# EasyEDA Pro project ProProject_基于STM32的Buck-Boost型数字电源_2024-06-04.epro, board PCB1
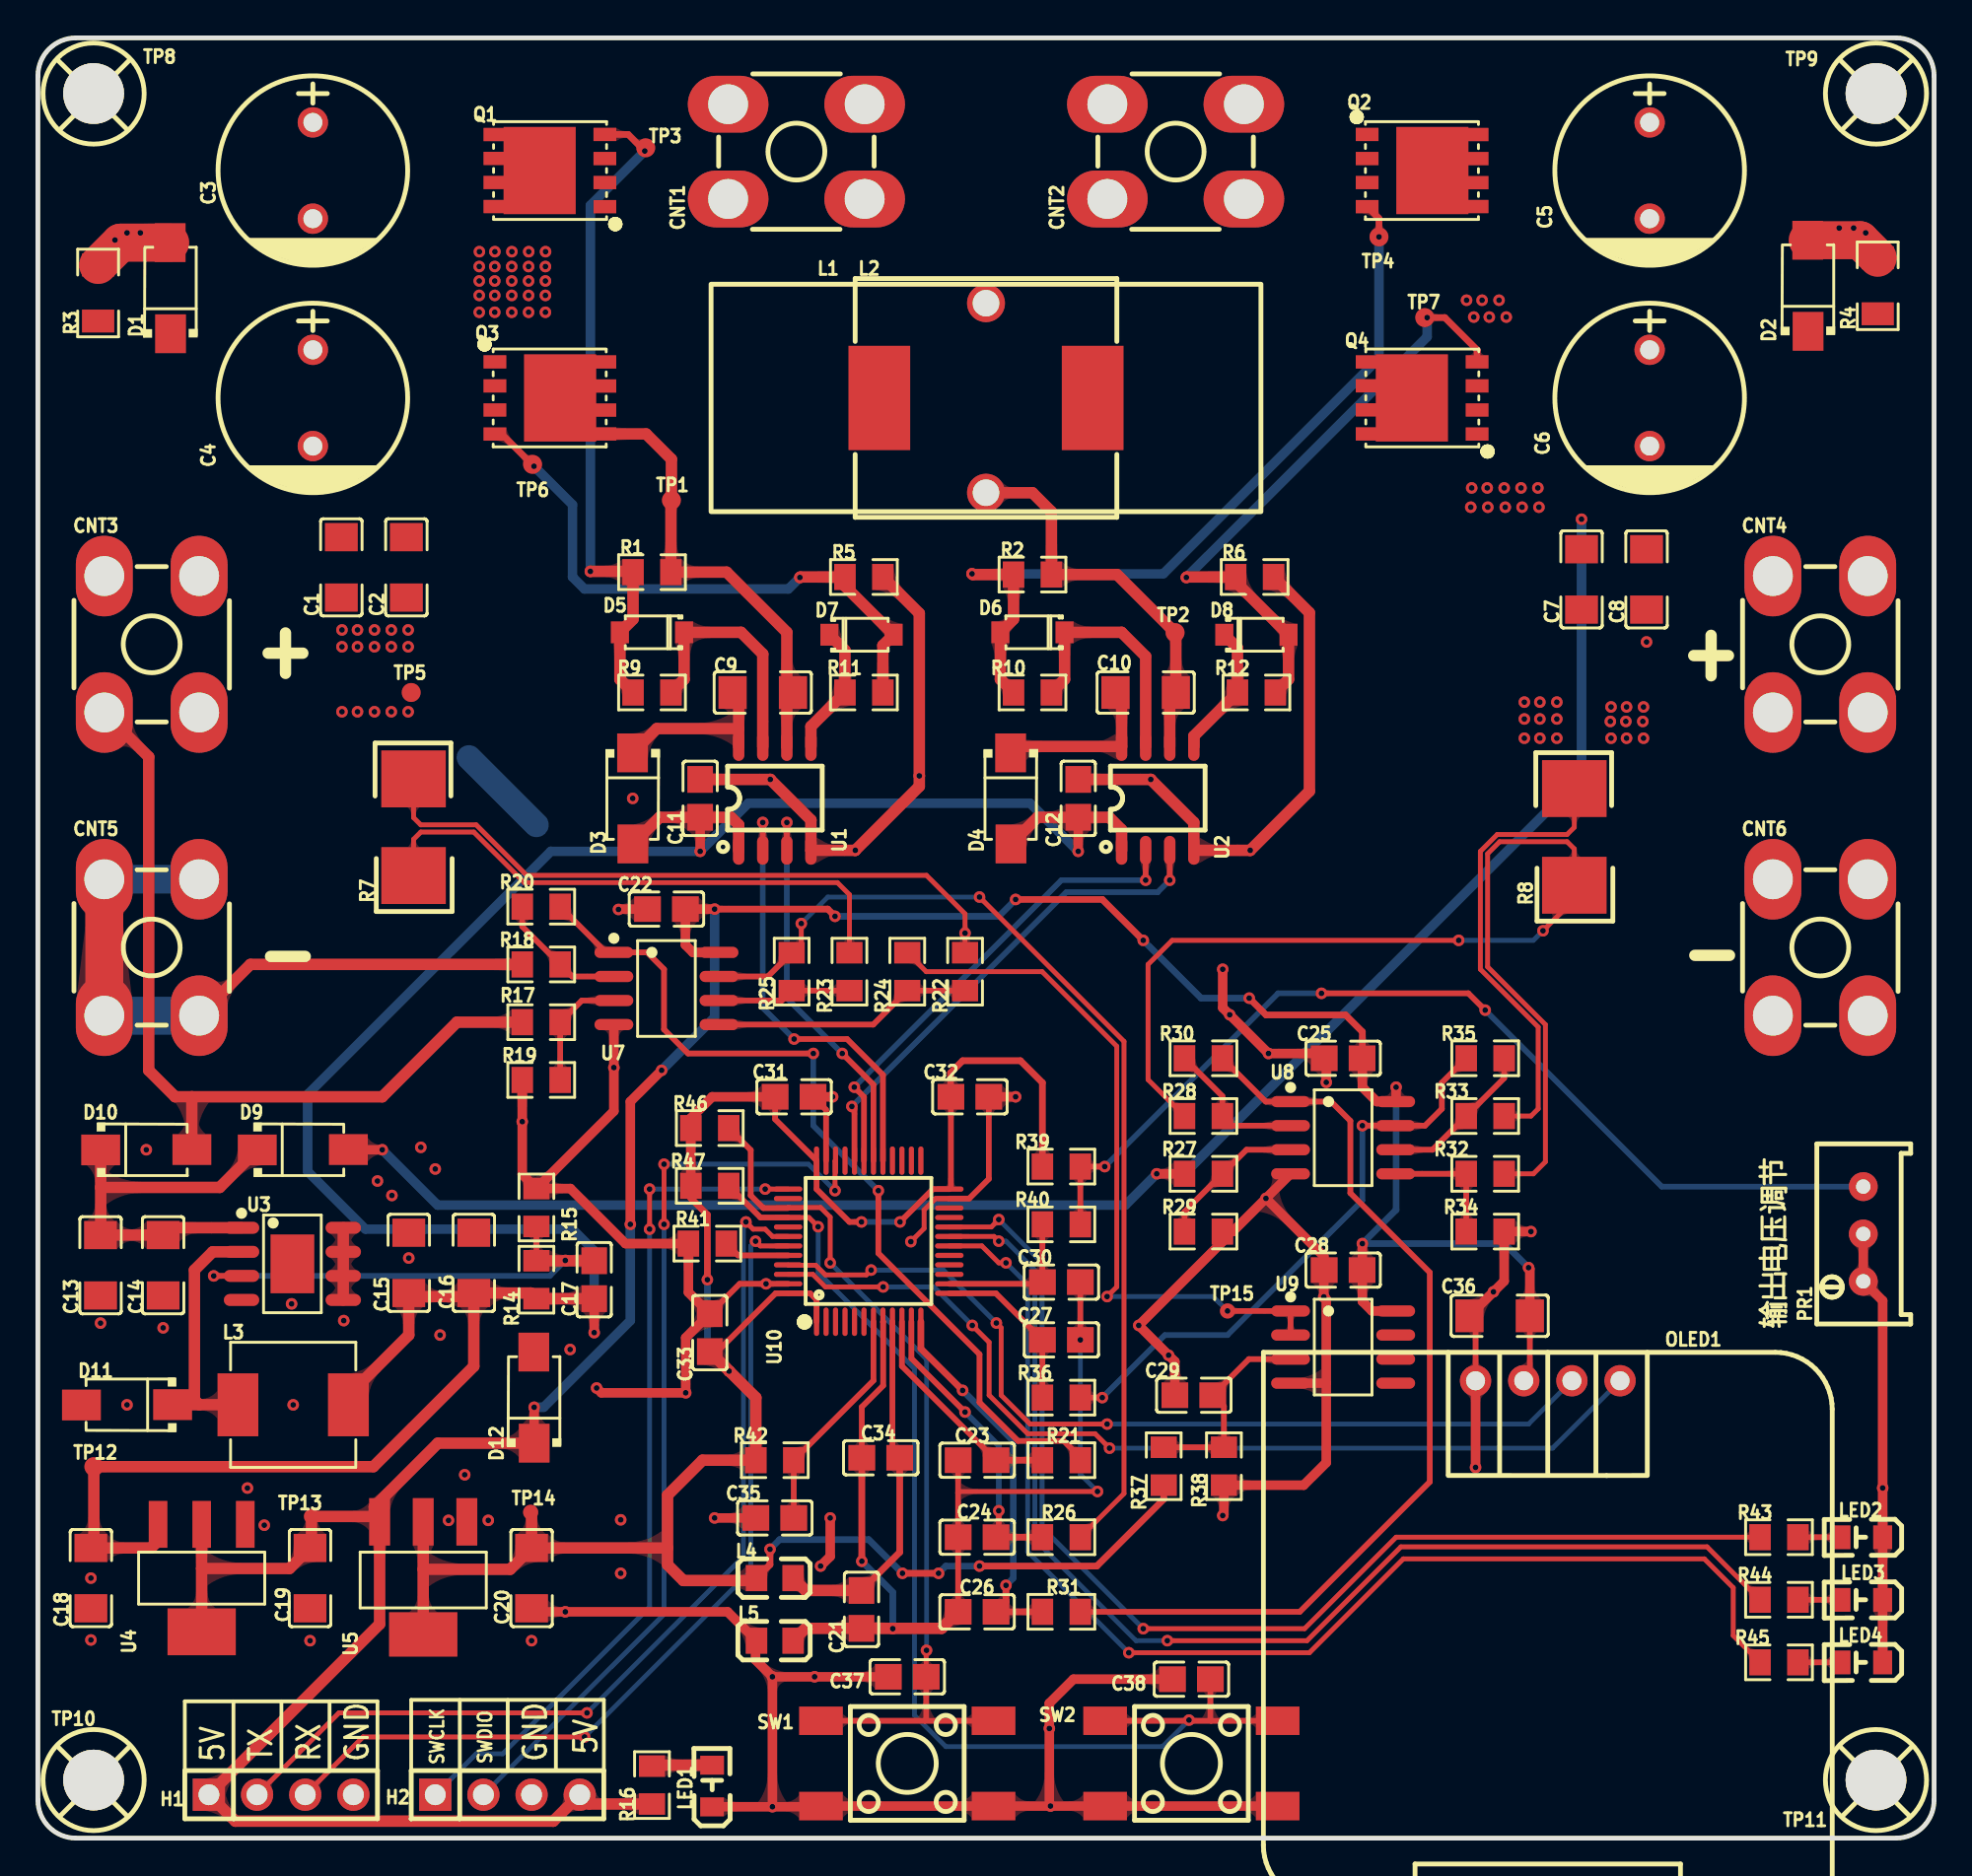
[diagram p13: board, top side]
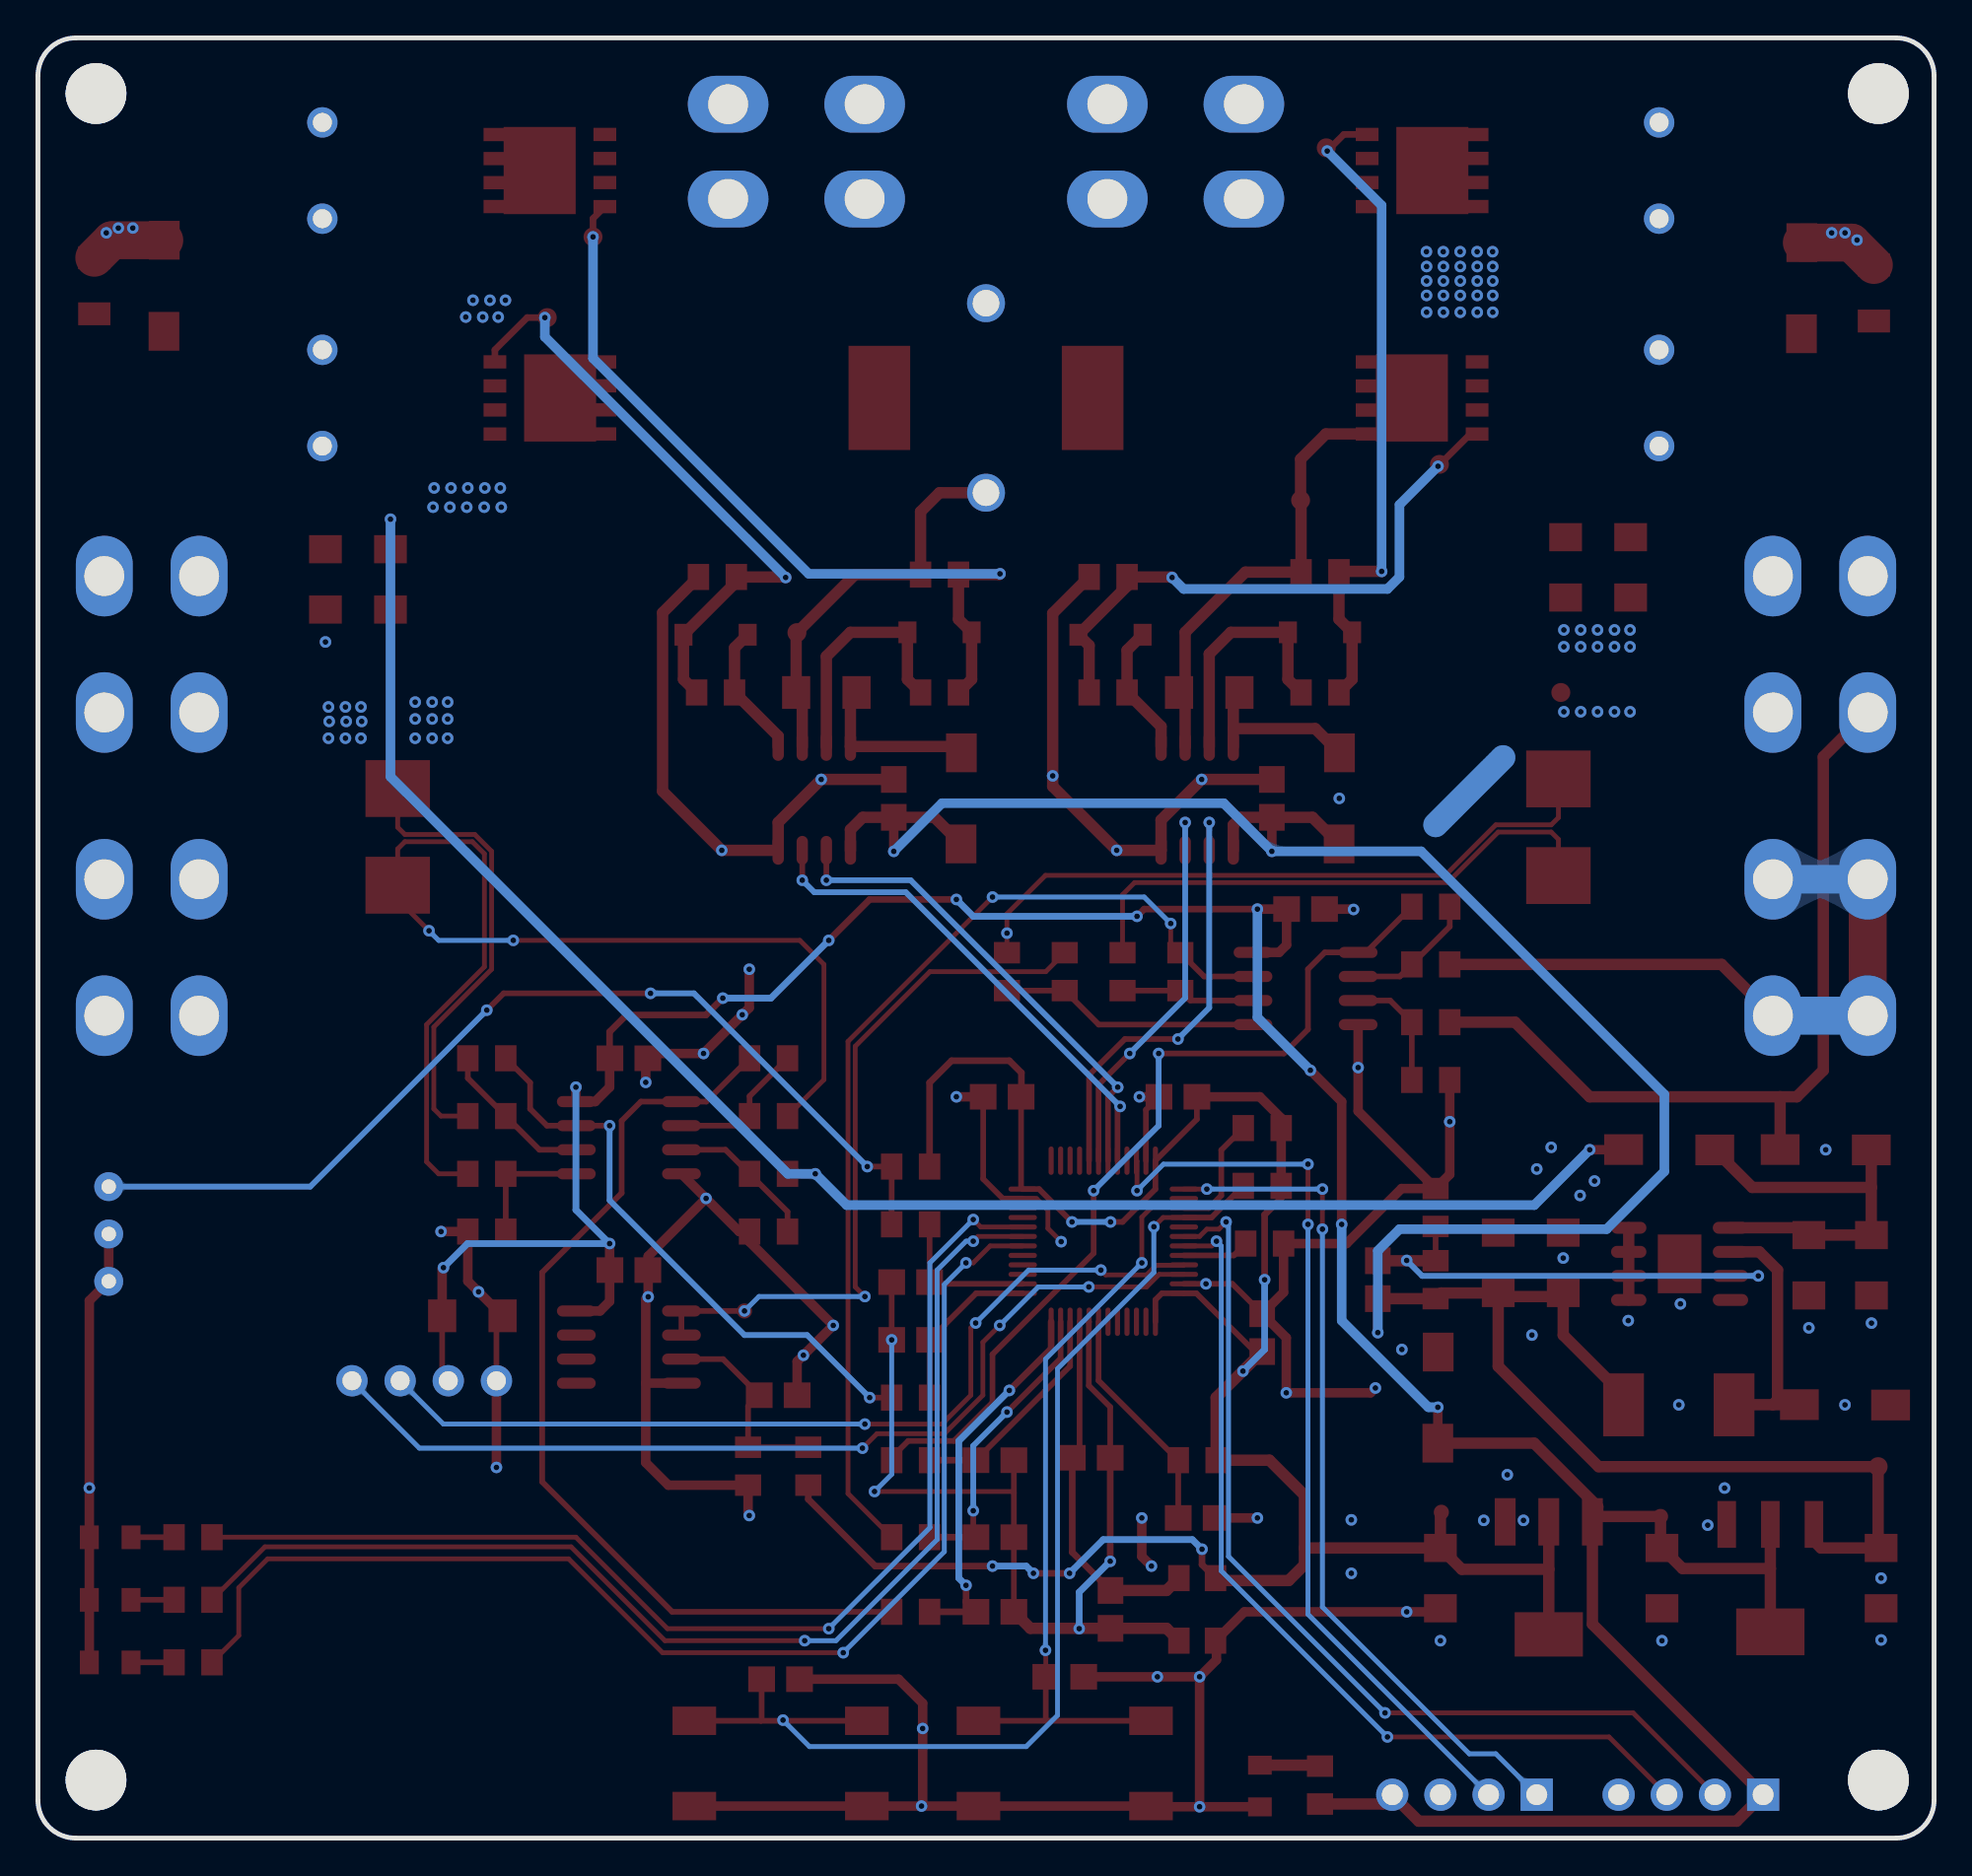
[diagram p14: board, bottom side, seen from below]

Outline 100 x 95 mm; copper layers: Top Layer, Bottom Layer. Coordinates in mm from the lower left corner of the outline.
Outline path: 0,93 0,2 arc(0.59,0.59) 2,0 98,0 arc(99.41,0.59) 100,2 100,93 arc(99.41,94.41) 98,95 2,95 arc(0.59,94.41) 0,93
Stack: Top Layer 0.035mm / Dielectric1 1.51mm FR4 er 4.5 / Bottom Layer 0.035mm

## Design rules (mm)
template: 自定义配置
spacing copperThickness1oz (default): track to track 0.102, other pairs 0.152 to 0.3
spacing copperThickness2oz: track to track 0.203, other pairs 0.152 to 0.3
track width copperThickness1oz (default): min 0.127, default 0.254, max 2.54
track width copperThickness2oz: min 0.203, default 0.254, max 2.54
differential pair differentialPair (default): width min 0.127, default 0.254, max 2.54; gap min 0.152, default 0.152
via viaSize (default): diameter min 0.5, default 0.61, max 10; hole min 0.3, default 0.305, max 6.3
net VIN+ uses 直连
net VIN- uses 直连
net GND uses 直连
net HS-1 uses 直连
net $1N2170 uses 直连
net HS-2 uses 直连
net VOUT+ uses 直连
net VOUT- uses 直连

## Placement (name value [footprint] x y rotation side)
C1  10uF  [C1206]  16 67.06 90 top
C2  10uF  [C1206]  19.43 67.06 90 top
C3  220uF  [CAP-TH_BD10.0-P5.00-D1.0-FD]  14.5 88 270 top
C4  220uF  [CAP-TH_BD10.0-P5.00-D1.0-FD]  14.5 76 270 top
C5  220uF  [CAP-TH_BD10.0-P5.00-D1.0-FD]  85 88 270 top
C6  220uF  [CAP-TH_BD10.0-P5.00-D1.0-FD]  85 76 270 top
C7  10uF  [C1206]  81.41 66.42 90 top
C8  10uF  [C1206]  84.84 66.42 90 top
C9  10uF  [C1206]  38.23 60.46 180 top
C10  10uF  [C1206]  58.42 60.46 180 top
C11  470nF  [C0805]  34.93 54.87 270 top
C12  470nF  [C0805]  54.86 54.87 270 top
C13  10uF  [C1206]  3.3 30.23 90 top
C14  10uF  [C1206]  6.6 30.23 90 top
C15  10uF  [C1206]  19.56 30.36 270 top
C16  10uF  [C1206]  22.99 30.36 270 top
C17  330pF  [C0805]  29.34 29.47 270 top
C18  10uF  [C1206]  2.79 13.72 90 top
C19  10uF  [C1206]  14.35 13.72 90 top
C20  10uF  [C1206]  26.03 13.72 90 top
C21  470nF  [C0805]  43.43 12.07 90 top
C22  470nF  [C0805]  33.15 49.03 180 top
C23  330pF  [C0805]  49.53 19.94 0 top
C24  330pF  [C0805]  49.53 15.88 0 top
C25  470nF  [C0805]  68.83 41.15 180 top
C26  330pF  [C0805]  49.53 11.94 0 top
C27  330pF  [C0805]  53.97 26.29 180 top
C28  470nF  [C0805]  68.83 29.98 180 top
C29  470nF  [C0805]  60.96 23.37 0 top
C30  470nF  [C0805]  53.97 29.34 180 top
C31  470nF  [C0805]  39.88 39.12 0 top
C32  470nF  [C0805]  49.15 39.12 0 top
C33  470nF  [C0805]  35.43 26.67 90 top
C34  470nF  [C0805]  44.45 20.07 0 top
C35  470nF  [C0805]  38.86 16.9 0 top
C36  10uF  [C1206]  77.09 27.56 0 top
C37  470nF  [C0805]  45.85 8.51 180 top
C38  470nF  [C0805]  60.83 8.39 180 top
CNT1  T34001  [CONN-TH_T34001]  40 89 90 top
CNT2  T34001  [CONN-TH_T34001]  60 89 90 top
CNT3  T34001  [CONN-TH_T34001]  6 63 0 top
CNT4  T34001  [CONN-TH_T34001]  94 63 0 top
CNT5  T34001  [CONN-TH_T34001]  6 47 0 top
CNT6  T34001  [CONN-TH_T34001]  94 47 0 top
D1  SS210  [SMA_L4.3-W2.6-LS5.0-RD]  6.98 81.79 90 top
D2  SS210  [SMA_L4.3-W2.6-LS5.0-RD]  93.34 81.92 90 top
D3  SS210  [SMA_L4.3-W2.6-LS5.0-RD]  31.37 54.87 270 top
D4  SS210  [SMA_L4.3-W2.6-LS5.0-RD]  51.31 54.87 270 top
D5  1N4148W  [SOD-123_L2.8-W1.8-LS3.7-RD]  32.38 63.63 180 top
D6  1N4148W  [SOD-123_L2.8-W1.8-LS3.7-RD]  52.45 63.63 180 top
D7  1N4148W  [SOD-123_L2.8-W1.8-LS3.7-RD]  43.43 63.5 0 top
D8  1N4148W  [SOD-123_L2.8-W1.8-LS3.7-RD]  64.26 63.5 0 top
D9  SS210  [SMA_L4.3-W2.6-LS5.0-RD]  13.97 36.33 0 top
D10  SS210  [SMA_L4.3-W2.6-LS5.0-RD]  5.72 36.33 0 top
D11  SS210  [SMA_L4.3-W2.6-LS5.0-RD]  4.7 22.86 180 top
D12  SS210  [SMA_L4.3-W2.6-LS5.0-RD]  26.16 23.25 90 top
H1  -  [HDR-TH_4P-P2.54-V-M]  12.83 2.29 0 top
H2  -  [HDR-TH_4P-P2.54-V-M]  24.77 2.29 0 top
L1  22uH  [IND-TH_L29.0-W12.0-P10.00]  50 76 270 top
L2  22uH  [IND-SMD_L13.5-W12.6_XR_XR1265]  50 76 0 top
L3  100uH  [IND-SMD_L7.1-W6.6]  13.46 22.86 0 top
L4  10uH  [L0805]  38.86 13.72 0 top
L5  10uH  [L0805]  38.86 10.42 0 top
LED1  NCD0805R1  [LED_0805]  35.56 2.8 90 top
LED2  NCD0805R1  [LED_0805]  96.14 15.88 180 top
LED3  NCD0805R1  [LED_0805]  96.14 12.58 180 top
LED4  NCD0805R1  [LED_0805]  96.14 9.28 180 top
OLED1  HS96L03W2C03  [0.96OLED_4P]  79.63 24.13 0 top
PR1  50kΩ  [R_3296]  96.14 31.88 90 top
Q1  CJAC80SN10  [PDFN-8_L5.8-W5.0-P1.27-LS6.0-BL]  27 88 90 top
Q2  CJAC80SN10  [PDFN-8_L5.8-W5.0-P1.27-LS6.0-BL]  73 88 270 top
Q3  CJAC80SN10  [PDFN-8_L5.8-W5.0-P1.27-LS6.0-BL]  27 76 270 top
Q4  CJAC80SN10  [PDFN-8_L5.8-W5.0-P1.27-LS6.0-BL]  73 76 90 top
R1  10kΩ  [R0805]  32.38 66.81 180 top
R2  10kΩ  [R0805]  52.45 66.68 180 top
R3  10kΩ  [R1206]  3.17 81.54 270 top
R4  10kΩ  [R1206]  97.03 81.92 270 top
R5  10kΩ  [R0805]  43.56 66.55 180 top
R6  10kΩ  [R0805]  64.17 66.55 180 top
R7  1mΩ  [RES-SMD_L6.4-W3.2-A]  19.81 53.34 90 top
R8  1mΩ  [RES-SMD_L6.4-W3.2-A]  81.03 52.84 90 top
R9  10Ω  [R0805]  32.38 60.46 0 top
R10  10Ω  [R0805]  52.45 60.46 0 top
R11  10Ω  [R0805]  43.56 60.46 180 top
R12  10Ω  [R0805]  64.26 60.46 180 top
R14  27kΩ  [R0805]  26.29 29.47 90 top
R15  3kΩ  [R0805]  26.29 33.28 90 top
R16  3kΩ  [R0805]  32.38 2.8 90 top
R17  68kΩ  [R0805]  26.54 43.06 0 top
R18  68kΩ  [R0805]  26.54 46.11 0 top
R19  3.3kΩ  [R0805]  26.54 40.01 180 top
R20  3.3kΩ  [R0805]  26.54 49.15 180 top
R21  100Ω  [R0805]  53.97 19.94 0 top
R22  100Ω  [R0805]  48.9 45.72 270 top
R23  100Ω  [R0805]  42.8 45.72 270 top
R24  15kΩ  [R0805]  45.85 45.72 90 top
R25  15kΩ  [R0805]  39.75 45.72 270 top
R26  100Ω  [R0805]  53.97 15.88 0 top
R27  68kΩ  [R0805]  61.47 35.06 0 top
R28  68kΩ  [R0805]  61.47 38.1 0 top
R29  3.3kΩ  [R0805]  61.47 32.01 0 top
R30  3.3kΩ  [R0805]  61.47 41.15 180 top
R31  100Ω  [R0805]  53.97 11.94 0 top
R32  100Ω  [R0805]  76.33 35.06 180 top
R33  100Ω  [R0805]  76.33 38.1 180 top
R34  15kΩ  [R0805]  76.33 32.01 0 top
R35  15kΩ  [R0805]  76.33 41.15 0 top
R36  100Ω  [R0805]  53.97 23.25 0 top
R37  3.3kΩ  [R0805]  59.37 19.63 270 top
R38  3.3kΩ  [R0805]  62.55 19.63 90 top
R39  10kΩ  [R0805]  53.97 35.44 0 top
R40  3.3kΩ  [R0805]  53.97 32.39 0 top
R41  1kΩ  [R0805]  35.31 31.37 180 top
R42  10kΩ  [R0805]  38.86 19.94 180 top
R43  3kΩ  [R0805]  91.82 15.88 0 top
R44  3kΩ  [R0805]  91.82 12.58 0 top
R45  3kΩ  [R0805]  91.82 9.28 0 top
R46  10kΩ  [R0805]  35.43 37.47 0 top
R47  10kΩ  [R0805]  35.43 34.42 0 top
SW1  KH-6X6X5H-STM  [SW-SMD_4P-L6.0-W6.0-P4.50-LS9.0-2]  45.85 3.94 0 top
SW2  KH-6X6X5H-STM  [SW-SMD_4P-L6.0-W6.0-P4.50-LS9.0-2]  60.83 3.94 0 top
TP1  -  [test-point-0.5mm#2]  33.41 70.6 0 top
TP2  -  [test-point-0.5mm#2]  59.97 63.62 0 top
TP3  -  [test-point-0.5mm#2]  32.06 89.2 0 top
TP4  -  [test-point-0.5mm#2]  70.73 84.5 0 top
TP5  -  [test-point-0.5mm#2]  19.69 60.46 0 top
TP6  -  [test-point-0.5mm#2]  26.09 72.49 0 top
TP7  -  [test-point-0.5mm#2]  73.14 80.24 0 top
TP8  -  [M3螺丝]  3 92 0 top
TP9  -  [M3螺丝]  97 92 0 top
TP10  -  [M3螺丝]  3 3 0 top
TP11  -  [M3螺丝]  97 3 0 top
TP12  -  [test-point-0.5mm#2]  2.95 19.6 0 top
TP13  -  [test-point-0.5mm]  14.43 16.97 0 top
TP14  -  [test-point-0.5mm]  25.99 17.19 0 top
TP15  -  [test-point-0.5mm]  62.74 27.82 0 top
U1  EG3112  [SOP-8_L5.0-W3.9-P1.27-LS6.0-BL]  38.86 54.87 0 top
U2  EG3112  [SOP-8_L5.0-W3.9-P1.27-LS6.0-BL]  59.06 54.87 0 top
U3  XL7005A  [SOIC-8_L4.9-W3.9-P1.27-LS6.0-BL-EP3.1-1]  13.42 30.3 270 top
U4  AMS1117-5.0  [SOT-223-4_L6.5-W3.5-P2.30-LS7.0-BR]  8.64 13.72 90 top
U5  AMS1117-3.3  [SOT-223-3_L6.5-W3.5-P3.05-LS7.0]  20.32 13.72 90 top
U7  GS8558-SR  [SOIC-8_L4.9-W3.8-P1.27-LS6.0-BL]  33.15 44.83 270 top
U8  GS8558-SR  [SOIC-8_L4.9-W3.8-P1.27-LS6.0-BL]  68.83 36.96 270 top
U9  GS8558-SR  [SOIC-8_L4.9-W3.8-P1.27-LS6.0-BL]  68.83 25.91 270 top
U10  STM32F334C8T6  [LQFP-48_L7.0-W7.0-P0.50-LS9.0-BL]  43.81 31.5 0 top

## Footprints (pads in the part's own frame, mm; a bottom-side part is the same pattern mirrored in y, then rotated)
0.96OLED_4P
  round 1.65 hole 1: 1(-3.81,-0.002) 2(-1.27,0.002) 3(1.27,0.002) 4(3.81,0.002)
C0805
  rect 1.41x1.35 smd: 1(-1,0) 2(1,0)
C1206
  rect 1.485x1.728 smd: 1(-1.593,0) 2(1.593,0)
CAP-TH_BD10.0-P5.00-D1.0-FD
  round 1.6 hole 1: 1(-2.54,0) 2(2.54,0)
CONN-TH_T34001
  oval 3x4.25 hole 2.1: 1(-2.5,-3.6) 2(2.5,-3.6) 3(2.5,3.6) 4(-2.5,3.6)
HDR-TH_4P-P2.54-V-M
  rect 1.7x1.7 hole 1.1: 1(-3.81,0)
  round 1.7 hole 1.1: 2(-1.27,0) 3(1.27,0) 4(3.81,0)
IND-SMD_L7.1-W6.6
  rect 2.15x3.32 smd: 1(-2.913,0) 2(2.913,0)
IND-SMD_L13.5-W12.6_XR_XR1265
  rect 3.25x5.5 smd: 1(-5.625,0) 2(5.625,0)
IND-TH_L29.0-W12.0-P10.00
  round 2 hole 1.4: 1(-5,0) 2(5,0)
L0805
  rect 1.133x1.377 smd: 1(-0.966,0) 2(0.966,0)
LED_0805
  rect 1x1.25 smd: 1(-1.15,0.005) 2(1.05,0.005)
LQFP-48_L7.0-W7.0-P0.50-LS9.0-BL
  oval 0.27x1.5 smd: 1(-2.75,-4.25) 2(-2.25,-4.25) 3(-1.75,-4.25) 4(-1.25,-4.25) 5(-0.75,-4.25) 6(-0.25,-4.25) 7(0.25,-4.25) 8(0.75,-4.25) 9(1.25,-4.25) 10(1.75,-4.25) 11(2.25,-4.25) 12(2.75,-4.25) 25(2.75,4.25) 26(2.25,4.25) 27(1.75,4.25) 28(1.25,4.25) 29(0.75,4.25) 30(0.25,4.25) 31(-0.25,4.25) 32(-0.75,4.25) 33(-1.25,4.25) 34(-1.75,4.25) 35(-2.25,4.25) 36(-2.75,4.25)
  oval 1.5x0.27 smd: 13(4.25,-2.75) 14(4.25,-2.25) 15(4.25,-1.75) 16(4.25,-1.25) 17(4.25,-0.75) 18(4.25,-0.25) 19(4.25,0.25) 20(4.25,0.75) 21(4.25,1.25) 22(4.25,1.75) 23(4.25,2.25) 24(4.25,2.75) 37(-4.25,2.75) 38(-4.25,2.25) 39(-4.25,1.75) 40(-4.25,1.25) 41(-4.25,0.75) 42(-4.25,0.25) 43(-4.25,-0.25) 44(-4.25,-0.75) 45(-4.25,-1.25) 46(-4.25,-1.75) 47(-4.25,-2.25) 48(-4.25,-2.75)
M3螺丝
  round 3.2 hole 3.2: 1(-0.064,0.064)
PDFN-8_L5.8-W5.0-P1.27-LS6.0-BL
  rect 0.7x1.2 smd: 1(-1.905,-2.9) 2(-0.635,-2.9) 3(0.635,-2.9) 4(1.905,-2.9) 5(1.9,2.9) 6(0.64,2.9) 7(-0.63,2.9) 8(-1.9,2.9)
  rect 4.6x3.8 smd: 9(0,0.54)
R0805
  rect 1.133x1.377 smd: 1(-1,0) 2(1,0)
R1206
  rect 1.208x1.701 smd: 1(-1.479,0) 2(1.479,0)
R_3296
  round 1.524 hole 0.762: 1(-2.499,-0.127) 2(0,-0.127) 3(2.499,-0.127)
RES-SMD_L6.4-W3.2-A
  rect 3x3.4 smd: 1(-2.55,0) 2(2.55,0)
SMA_L4.3-W2.6-LS5.0-RD
  rect 2.046x1.62 smd: 1(-2.404,-0.009) 2(2.404,0.009)
SOD-123_L2.8-W1.8-LS3.7-RD
  rect 0.95x1.15 smd: 1(-1.692,0) 2(1.692,0)
SOIC-8_L4.9-W3.8-P1.27-LS6.0-BL
  oval 0.588x2.045 smd: 1(-1.905,-2.772) 2(-0.635,-2.772) 3(0.635,-2.772) 4(1.905,-2.772) 5(1.905,2.772) 6(0.635,2.772) 7(-0.635,2.772) 8(-1.905,2.772)
SOIC-8_L4.9-W3.9-P1.27-LS6.0-BL-EP3.1-1
  oval 0.63x1.865 smd: 1(-1.905,-2.683) 2(-0.635,-2.683) 3(0.635,-2.683) 4(1.905,-2.683) 5(1.905,2.683) 6(0.635,2.683) 7(-0.635,2.683) 8(-1.905,2.683)
  rect 3.1x2.3 smd: 9(0,0)
SOP-8_L5.0-W3.9-P1.27-LS6.0-BL
  oval 0.6x1.52 smd: 1(-1.905,-2.74) 2(-0.635,-2.74) 3(0.635,-2.74) 4(1.905,-2.74) 5(1.905,2.74) 6(0.635,2.74) 7(-0.635,2.74) 8(-1.905,2.74)
SOT-223-3_L6.5-W3.5-P3.05-LS7.0
  rect 2.5x1.1 smd: 1(2.97,-2.3) 2(2.97,0) 3(2.97,2.3)
  rect 2.34x3.6 smd: 4(-2.97,0)
SOT-223-4_L6.5-W3.5-P2.30-LS7.0-BR
  rect 2.47x0.98 smd: 1(2.835,-2.3) 2(2.835,0) 3(2.835,2.3)
  rect 2.47x3.6 smd: 4(-2.835,0)
SW-SMD_4P-L6.0-W6.0-P4.50-LS9.0-2
  rect 2.3x1.5 smd: 1(-4.55,2.25) 2(4.55,2.25) 3(-4.55,-2.25) 4(4.55,-2.25)
test-point-0.5mm
  round 0.8 smd: 1(0,0)
test-point-0.5mm#2
  round 1 smd: 1(0,0)

## Nets
As in the schematic, except:
GND: C1.1 C2.1 C3.2 C4.2 C5.2 C6.2 C7.1 C8.1 C11.1 C12.1 C13.1 C14.1 C15.1 C16.1 C18.1 C19.1 C20.1 C22.2 C25.2 C28.2 C29.1 C31.2 C32.2 C33.2 C35.1 C36.1 C37.2 C38.2 D1.2 D2.2 D11.2 D12.2 H1.4 H2.3 L5.1 LED1.1 LED2.1 LED3.1 LED4.1 OLED1.1 PR1.1 PR1.2 Q3.1 Q3.2 Q3.3 Q4.1 Q4.2 Q4.3 R3.1 R4.1 R5.1 R6.1 R7.2 R8.2 R15.2 R19.2 R22.1 R29.2 R33.1 R34.2 R38.1 R41.2 SW1.3 SW1.4 SW2.3 SW2.4 TP5.1 U1.4 U2.4 U3.5 U3.6 U3.7 U3.8 U3.9 U4.1 U5.1 U7.4 U8.4 U9.4 U10.23 U10.35 U10.47
P5V: C19.2 C22.1 C25.1 C28.1 C36.2 D12.1 H1.1 H2.4 OLED1.2 R16.1 TP13.1 U4.2 U4.4 U5.3 U7.8 U8.8 U9.8
ADC_IIN: C24.2 R26.1 U10.11
ADC_IOUT: C27.2 R36.1 U10.13
ADC_VIN: C23.2 R21.1 U10.10
ADC_VOUT: C26.2 R31.1 U10.12
GATE1-H: D5.2 Q1.4 R1.2 R9.1 TP3.1
GATE1-L: D7.2 Q3.4 R5.2 R11.1 TP6.1
GATE2-H: D6.2 Q2.4 R2.2 R10.1 TP4.1
GATE2-L: D8.2 Q4.4 R6.2 R12.1 TP7.1
I2C1_SCL: OLED1.3 U10.45
I2C1_SDA: OLED1.4 U10.46

Pads without a net: TP8 1; TP9 1; TP10 1; TP11 1; U3 4; U9 5 6 7; U10 2 3 4 5 6 15 16 17 21 22 25 26 27 28 33 38 41

## Via types
v1: diameter 0.61, hole 0.305, Top Layer to Bottom Layer, 234 vias

## Routing (per net, layer and track width the routed paths; a pad name or vN(x,y) marks a point on that pad's centre or on a via; arc(x,y) is an arc through that point)
A3V3: length 19.1
  Top Layer w0.3: U10.9 45.06,20.46 C34.2
  Top Layer w0.35: C34.2 45.45,15.09 C21.2
  Top Layer w0.6: L4.2 40.48,13.07 C21.2
AGND: length 53.5
  Top Layer w0.254: v1(55.88,18.29) 48.59,18.29 48.53,18.23
  Top Layer w0.3: C23.1 C24.1 C26.1 ; v1(54.97,26.29) C30.1 ; C34.1 43.45,22.75 44.58,23.88 44.58,27.24 U10.8
  Top Layer w0.35: v1(45.09,11.05) 45.1,11.07 ; C34.1 v1(43.45,14.61)
  Top Layer w0.6: C26.1 47.66,11.07 C21.1 40.48,11.07 L5.2
  Bottom Layer w0.254: v1(54.97,26.29) 54.97,19.2 v1(55.88,18.29)
  Bottom Layer w0.35: v1(43.45,14.61) 45.09,12.97 v1(45.09,11.05)
GND: length 357.9
  Top Layer w0.254: R7.2 19.81,53.85 20.19,53.47 23.11,53.47 25.78,50.8 46.86,50.8 48.9,48.77 v1(48.9,47.76) R22.1 ; R8.2 81.03,53.34 80.65,52.96 76.96,52.96 76.07,52.07 76.07,45.85 79.12,42.8 79.12,38.48 78.74,38.1 R33.1 ; v1(46.04,31.47) 46.74,32.17 46.74,33.15 47.34,33.75 U10.23
  Top Layer w0.3: U10.23 49.11,33.75 50.15,34.79 C32.2 ; C33.2 37.01,29.25 v1(38.4,29.25) U10.47 ; C31.2 41.56,38.43 U10.35 ; C36.1 75.82,27.24 OLED1.1
  Top Layer w0.5: v1(38.74,1.66) 41.26,1.66 SW1.3 v1(53.4,1.69) ; v1(38.74,1.66) 35.56,1.66 LED1.1 ; v1(38.74,1.66) v1(38.74,8.51) ; v1(38.74,8.51) 37.85,9.4 37.85,10.37 L5.1 36.37,11.94 v1(27.81,11.94) 26.22,11.94 C20.1 ; v1(38.74,8.51) v1(40.96,8.51) C37.2 ; v1(53.4,1.69) 53.34,1.75 v1(53.34,5.78) 53.34,7.12 54.61,8.39 C38.2 ; v1(53.4,1.69) SW2.3 SW2.4 ; 67.82,29.96 67.82,30.71 v1(64.76,33.76) ; 67.82,29.96 v1(67.82,28.56) 67.94,28.43 67.94,24.01 ; 67.82,29.96 C28.2 ; C22.2 30.64,49.03 v1(30.62,49.01) ; R15.2 28.08,34.28 30.99,31.37 R41.2 ; R15.2 25.54,35.02 v1(25.54,37.81) R19.2 ; R15.2 30.37,38.36 v1(30.37,40.66) U7.4 ; 34.54,31.37 R41.2 ; R41.2 34.31,28.8 C33.2 34.16,26.4 v1(34.16,23.5) 29.72,23.5 v1(29.46,23.75) ; v1(67.94,39.88) 67.94,41.04 C25.2 67.58,41.41 v1(64.9,41.41) v1(62.85,43.45) 62.48,43.82 v1(62.48,45.85) ; v1(62.48,17.02) 62.55,17.09 R38.1 66.75,18.63 67.94,19.82 67.94,24.01 ; PR1.2 PR1.1 97.29,28.36 v1(97.29,18.48) 97.29,9.27 ; v1(64.76,33.76) 63.01,32.01 R29.2 62.47,31.47 v1(58.06,27.06) v1(59.63,25.48) 59.96,25.15 C29.1 ; v1(64.76,33.76) U8.4 ; C35.1 v1(35.69,16.9) ; v1(78.74,32.01) R34.2 77.33,29.39 v1(76.76,28.83) C36.1 ; U9.4 67.94,24.01 ; v1(75.82,19.56) OLED1.1 ; v1(51.56,39.12) C32.2 ; v1(41.78,16.9) 41.78,14.86 v1(41.28,14.35) ; C31.2 v1(41.91,39.12)
  Top Layer w0.6: R5.1 46.48,64.63 v1(46.48,56.06) 46.48,55.5 v1(43.11,52.13) U1.4 40.77,53.72 v1(38.62,55.87) C11.1 ; U3.5 U3.6 U3.7 U3.8 ; R6.1 67.06,64.66 67.06,55.25 v1(63.94,52.13) U2.4 60.96,53.6 v1(58.69,55.87) C12.1
  Top Layer w2: D2.2 96.1,84.32 R4.1 ; R3.1 4.35,84.2 D1.2
  Bottom Layer w1.3: 22.73,57.03 26.29,53.47
  vias: v1(2.79,13.72) v1(2.79,10.46) v1(3.3,27.18) v1(4.06,84.33) v1(4.7,84.71) v1(4.7,22.86) v1(5.4,84.71) v1(5.72,36.33) v1(6.6,26.93) v1(11.05,18.47) v1(11.94,16.51) v1(13.38,28.19) v1(13.46,22.86) v1(14.35,10.42) v1(16.03,63.76) v1(16.03,62.87) v1(16.03,59.44) v1(16.13,27.31) v1(16.85,63.76) v1(16.85,62.87) v1(16.85,59.44) v1(17.75,63.76) v1(17.75,62.87) v1(17.75,59.44) v1(17.91,34.67) v1(18.64,63.76) v1(18.64,62.87) v1(18.64,59.44) v1(18.67,33.91) v1(19.53,63.76) v1(19.53,62.87) v1(19.53,59.44) v1(19.56,30.61) v1(20.19,36.45) v1(20.95,35.31) v1(21.21,26.55) v1(21.65,16.77) v1(22.51,19.17) v1(23.28,83.72) v1(23.27,82.94) v1(23.27,82.17) v1(23.27,81.41) v1(23.27,80.52) v1(23.75,16.77) v1(24.1,83.72) v1(24.09,82.94) v1(24.09,82.17) v1(24.09,81.41) v1(24.09,80.52) v1(24.99,83.72) v1(24.99,82.94) v1(24.99,82.17) v1(24.99,81.41) v1(24.99,80.52) v1(25.88,83.72) v1(25.88,82.94) v1(25.88,82.17) v1(25.88,81.41) v1(25.88,80.52) v1(26.03,10.42) v1(26.77,83.72) v1(26.76,82.94) v1(26.76,82.17) v1(26.76,81.41) v1(26.76,80.52) v1(28.07,25.78) v1(30.73,16.8) v1(30.73,13.97) v1(31.37,54.87) v1(75.34,81.16) v1(75.61,71.25) v1(75.56,70.23) v1(75.72,80.27) v1(76.16,81.16) v1(76.43,71.25) v1(76.54,80.27) v1(76.47,70.23) v1(77.06,81.16) v1(77.33,71.25) v1(77.44,80.27) v1(77.38,70.23) v1(78.22,71.25) v1(78.27,70.23) v1(78.39,59.95) v1(78.39,59.06) v1(78.39,58.04) v1(79.1,71.25) v1(79.16,70.23) v1(79.21,59.95) v1(79.21,59.06) v1(79.21,58.04) v1(80.1,59.95) v1(80.1,59.06) v1(80.1,58.04) v1(82.93,58.93) v1(82.96,59.69) v1(82.96,58.04) v1(83.74,58.93) v1(83.78,59.69) v1(83.78,58.04) v1(84.64,58.93) v1(84.68,59.69) v1(84.68,58.04) v1(84.84,63.12) v1(95,84.97) v1(95.76,84.97) v1(96.39,84.71)
P1V65: length 37.8
  Top Layer w0.254: v1(56.39,28.58) 56.9,29.09 56.9,41.79 52.96,45.72 46.85,45.72 R24.2
  Top Layer w0.3: U9.2 U9.1 v1(62.74,27.82)
  Bottom Layer w0.254: v1(62.74,27.82) 61.98,28.58 v1(56.39,28.58)
P3V3: length 125.8
  Top Layer w0.3: U10.1 41.06,28.41 40.72,28.75 U10.48 38.91,28.75 35.83,25.67 C33.1 ; v1(45.47,32.52) 47.2,34.25 U10.24 48.15,34.33 C32.1 ; C31.1 38.88,37.94 U10.36 41.06,34.25 42.8,32.52 v1(43.43,32.52)
  Top Layer w0.35: v1(47.5,13.97) v1(45.59,13.97) ; v1(38.61,15.24) 38.61,14.43 L4.1 ; v1(35.31,29.47) 35.31,32.9 34.43,33.77 R47.1 ; C32.1 48.13,39.14 48.13,40.39 48.77,41.03 51.82,41.03 52.97,39.87 R39.1 ; v1(36.45,24.64) 36.47,24.62 36.49,24.62 ; v1(49.66,14.35) 55.84,14.35 59.37,17.88 R37.2
  Top Layer w0.5: C31.1 35.56,39.12 34.43,37.99 R46.1 R47.1
  Top Layer w0.6: L4.1 37.77,13.59 34.04,13.59 33.21,14.42 33.21,15.31 ; 20.32,14.19 24.91,14.19 C20.2 ; 20.32,14.19 U5.2 ; 20.32,14.19 U5.4 ; TP14.1 26.03,17.15 C20.2 ; 33.21,15.31 33.21,18.1 35.05,19.94 R42.2 37.86,23.25 C33.1 ; 33.21,15.31 C20.2
  Bottom Layer w0.3: v1(43.43,32.52) v1(45.47,32.52)
  Bottom Layer w0.35: v1(49.66,14.35) 47.88,14.35 v1(47.5,13.97) ; v1(38.61,15.24) 39.12,15.75 43.81,15.75 v1(45.59,13.97) ; v1(36.45,24.64) 35.31,25.78 v1(35.31,29.47)
P5V: length 181
  Top Layer w0.3: 78.36,24.14 78.68,24.46 C36.2
  Top Layer w0.35: v1(35.69,49.03) 41.66,49.03 v1(42.04,48.64) ; v1(58.29,47.38) 56.13,49.53 v1(51.56,49.53) ; C25.1 69.85,41.17 69.85,42.55 68.96,43.44 64.77,43.44 v1(63.88,44.33)
  Top Layer w0.5: U7.8 34.54,46.74 34.15,47.14 C22.1 v1(35.69,49.03) ; v1(78.61,30.1) 78.68,30.03 C36.2 ; C25.1 69.85,41.14 69.85,39.63 70.61,38.87 U8.8 71.63,38.89 v1(71.63,39.63) ; D12.1 v1(26.17,22.74) ; U9.8 70.36,27.82 69.85,28.33 69.85,29.96 C28.1 69.85,29.99 v1(69.85,31.37) ; v1(32.89,40.52) 31.24,38.87 v1(31.24,32.39)
  Top Layer w0.6: U4.2 8.64,14.23 ; 8.64,14.23 13.27,14.23 C19.2 14.43,15.39 TP13.1 17.74,16.97 ; 8.64,14.23 U4.4 ; 17.74,16.97 U5.3 18.02,11.29 H1.1 10.41,0.89 27.18,0.89 H2.4 29.07,1.8 R16.1 ; 17.74,16.97 17.74,17.49 21.09,20.84 D12.1
  Bottom Layer w0.35: v1(58.29,47.38) 61.34,44.33 v1(63.88,44.33) ; v1(78.61,30.1) 77.34,31.37 v1(69.85,31.37) 71.63,33.15 v1(71.63,39.63) ; v1(42.04,48.64) 50.67,48.64 v1(51.56,49.53)
  Bottom Layer w0.5: v1(32.89,40.52) 35.69,43.31 v1(35.69,49.03) ; v1(26.17,22.74) 26.67,22.74 31.24,27.31 v1(31.24,32.39)
P12V: length 146.1
  Top Layer w0.5: v1(54.86,52.07) C12.2 ; C17.2 v1(29.34,26.67) ; v1(34.93,52.07) C11.2
  Top Layer w0.6: U1.1 36.96,53.47 36.56,53.87 C11.2 32.78,53.87 D3.2 ; C16.2 22.8,28.58 19.81,28.58 ; C16.2 25.99,28.76 R14.1 C17.2 ; C16.2 22.99,24.9 17.69,19.6 TP12.1 2.95,15.47 C18.2 5.97,15.31 6.34,15.68 U4.3 ; C15.2 19.56,26.55 16.38,23.36 L3.2 ; D4.2 52.72,53.87 C12.2 56.5,53.87 57.15,53.22 U2.1
  Bottom Layer w0.5: v1(29.34,26.67) 29.34,30.99 28.19,32.14 17.27,32.14 14.22,35.18 14.22,39.25 27.05,52.07 v1(34.93,52.07) 37.47,54.61 52.32,54.61 v1(54.86,52.07)
VIN+: length 44.5
  Top Layer w0.6: 8.12,39.12 18.16,39.12 22.1,43.06 R17.1 ; 8.12,39.12 7.24,39.12 5.84,40.52 5.84,57.06 CNT3.1 ; 8.12,39.12 D10.2
VIN-: length 64.9
  Top Layer w0.254: R7.1 19.81,52.71 20.19,53.09 22.99,53.09 25.65,50.42 42.16,50.42 42.8,49.79 R23.1
  Top Layer w0.6: R18.1 11.2,46.11 CNT5.2
  Top Layer w2: CNT5.4 CNT5.1
  Bottom Layer w1.5: CNT5.4 CNT5.3
  Bottom Layer w2: CNT5.1 CNT5.2
ADC_IIN: length 15.8
  Top Layer w0.3: U10.11 46.06,25.31 v1(48.9,22.48) ; C24.2 50.67,16.02 v1(50.67,17.28)
  Top Layer w0.35: R26.1 C24.2
  Bottom Layer w0.3: v1(48.9,22.48) 50.67,20.71 v1(50.67,17.28)
ADC_IOUT: length 9
  Top Layer w0.3: R36.1 C27.2 50.52,28.75 U10.13
ADC_VADJ: length 8
  Top Layer w0.3: U10.14 52.88,29.25 C30.2 R40.1
ADC_VIN: length 11.8
  Top Layer w0.3: C23.2 45.56,24.91 U10.10
  Top Layer w0.35: R21.1 C23.2
ADC_VOUT: length 20.1
  Top Layer w0.35: U10.12 46.56,25.83 v1(48.77,23.63) ; v1(51.05,13.34) 51.05,12.47 C26.2 R31.1
  Bottom Layer w0.35: v1(51.05,13.34) 51.44,13.72 51.44,20.96 v1(48.77,23.63)
GATE1-H: length 35
  Top Layer w0.35: Q1.4 31.13,89.91 v1(32,89.03)
  Top Layer w0.6: R9.1 30.69,61.15 D5.2 31.38,64.32 R1.2 31.34,66.85 v1(29.13,66.85)
  Bottom Layer w0.5: v1(29.13,66.85) 29.13,86.16 v1(32,89.03)
GATE1-L: length 31.7
  Top Layer w0.35: Q3.4 24.46,74.09 v1(26.16,72.39)
  Top Layer w0.6: R11.1 44.56,62.94 D7.2 42.56,66.07 R5.2 40.21,66.55 v1(40.18,66.53)
  Bottom Layer w0.5: v1(40.18,66.53) 39.58,65.92 28.83,65.92 28.19,66.55 28.19,70.36 v1(26.16,72.39)
GATE2-H: length 43.4
  Top Layer w0.35: v1(70.73,84.5) 70.73,85.47 Q2.4
  Top Layer w0.6: v1(49.26,66.72) 49.3,66.68 R2.2 51.45,64.32 D6.2 50.76,61.15 R10.1
  Bottom Layer w0.5: v1(49.26,66.72) 59.35,66.72 70.73,78.1 v1(70.73,84.5)
GATE2-L: length 33.1
  Top Layer w0.35: v1(73.27,80.24) 74.19,80.24 75.9,78.54 Q4.4
  Top Layer w0.6: R12.1 65.95,61.15 D8.2 63.17,66.29 R6.2 60.59,66.55 v1(60.57,66.53)
  Bottom Layer w0.5: v1(60.57,66.53) 73.27,79.22 v1(73.27,80.24)
HS-1: length 23.9
  Top Layer w0.6: U1.6 39.5,60.13 ; 39.5,60.13 C9.1 ; 39.5,60.13 39.5,63.63 36.32,66.81 R1.1 33.38,70.32 33.41,70.35 33.41,72.77 32.08,74.1 Q3.5
HS-2: length 21.1
  Top Layer w0.6: L1.2 50,71 52.45,71 53.45,70 R2.1 56.91,66.68 TP2.1 60.01,63.57 C10.1 59.69,60.13 U2.6
I2C1_SCL: length 48.1
  Top Layer w0.254: v1(43.94,29.98) 43.69,29.72 41.53,29.72 41.02,30.23 39.59,30.23 U10.45 ; v1(56.39,21.85) 52.32,21.85 50.8,23.37 50.8,26.93 v1(50.55,27.18)
  Bottom Layer w0.254: v1(50.55,27.18) 47.75,29.98 v1(43.94,29.98) ; OLED1.3 78.61,21.85 v1(56.39,21.85)
I2C1_SDA: length 50.8
  Top Layer w0.254: v1(56.51,20.58) 55.75,21.34 52.2,21.34 50.16,23.37 50.16,26.17 v1(49.28,27.06) ; U10.46 40.87,29.75 41.53,29.09 v1(44.58,29.09)
  Bottom Layer w0.254: v1(49.28,27.06) 47.24,29.09 v1(44.58,29.09) ; OLED1.4 79.88,20.58 v1(56.51,20.58)
KEY1: length 46.5
  Top Layer w0.254: U10.39 39.59,33.28 41.28,33.28 41.78,32.77 v1(41.78,30.36) ; v1(46.86,9.91) 46.85,9.89 C37.1
  Top Layer w0.3: 46.78,6.19 46.85,6.26 C37.1 ; 46.78,6.19 50.4,6.19 ; 46.78,6.19 41.3,6.19 ; U10.39 38.25,33.25 37.59,33.91 37.59,36.31 R46.2
  Bottom Layer w0.254: v1(46.86,9.91) 46.86,25.28 v1(41.78,30.36)
KEY2: length 60.6
  Top Layer w0.254: U10.40 40.66,32.75 v1(41.15,32.26) ; v1(60.71,6.23) 60.66,6.23 60.63,6.19
  Top Layer w0.3: 61.87,6.19 61.83,6.23 C38.1 ; 61.87,6.19 65.38,6.19 ; 61.87,6.19 SW2.1 ; R47.2 38.1,32.75 U10.40
  Bottom Layer w0.254: v1(41.15,32.26) 41.15,29.85 46.23,24.77 46.23,6.48 47.88,4.83 59.31,4.83 v1(60.71,6.23)
LED_G: length 65.7
  Top Layer w0.254: v1(57.53,9.78) 67.06,9.78 72.01,14.74 87.88,14.74 89.41,13.21 89.41,10.69 R45.1 ; U10.18 49.78,31.25 50.67,30.36 v1(51.05,30.36)
  Bottom Layer w0.254: v1(51.05,30.36) 52.2,29.21 52.2,15.12 v1(57.53,9.78)
LED_R: length 62
  Top Layer w0.254: v1(58.29,11.05) 66.8,11.05 71.63,15.88 R43.1 ; v1(50.67,32.64) 50.28,32.25 U10.20
  Bottom Layer w0.254: v1(50.67,32.64) 52.96,30.36 52.96,16.39 v1(58.29,11.05)
LED_Y: length 63
  Top Layer w0.254: v1(50.67,31.5) 50.42,31.75 U10.19 ; R44.1 88.03,15.37 71.88,15.37 66.93,10.42 v1(59.56,10.42)
  Bottom Layer w0.254: v1(59.56,10.42) 57.91,10.42 52.58,15.75 52.58,29.98 51.05,31.5 50.8,31.5
PWM1H: length 23.6
  Top Layer w0.3: U10.29 44.56,40.28 42.67,42.17 v1(39.88,42.17) ; v1(38.23,53.6) U1.2
  Bottom Layer w0.3: v1(39.88,42.17) 38.23,43.82 v1(38.23,53.6)
PWM1L: length 21.2
  Top Layer w0.3: v1(39.5,53.6) U1.3 ; U10.30 44.06,39.76 v1(42.42,41.41)
  Bottom Layer w0.3: v1(42.42,41.41) 39.5,44.33 v1(39.5,53.6)
PWM2H: length 25.6
  Top Layer w0.3: v1(43.05,39.63) 43.56,39.12 U10.31 ; v1(58.42,50.55) U2.2
  Bottom Layer w0.3: v1(43.05,39.63) 53.97,50.55 v1(58.42,50.55)
PWM2L: length 26.2
  Top Layer w0.3: U10.32 43.06,38.47 v1(42.93,38.61) ; v1(59.69,50.55) U2.3
  Bottom Layer w0.3: v1(59.69,50.55) 59.06,49.92 54.23,49.92 v1(42.93,38.61)
SWCLK: length 44.8
  Top Layer w0.254: v1(32.26,34.25) v1(32.26,32.14) ; U10.37 v1(38.35,34.25)
  Bottom Layer w0.254: v1(38.35,34.25) v1(32.26,34.25) ; H2.1 23.11,4.45 24.51,4.45 32.26,12.2 v1(32.26,32.14)
SWDIO: length 48.4
  Top Layer w0.254: U10.34 42.04,35.72 v1(42.04,34.17) ; v1(33.02,32.39) v1(33.02,35.56)
  Bottom Layer w0.254: v1(33.02,32.39) 33.02,11.81 H2.2 ; v1(42.04,34.17) 40.64,35.56 v1(33.02,35.56)
USART1_RX: length 47.7
  Top Layer w0.254: v1(28.83,5.34) 17.14,5.34 H1.3 ; v1(37.85,31.5) 38.1,31.25 U10.43
  Bottom Layer w0.254: v1(28.83,5.34) 37.59,14.1 37.59,31.25 v1(37.85,31.5)
USART1_TX: length 51.1
  Top Layer w0.254: U10.42 38.74,31.75 38.35,32.14 37.72,32.14 v1(37.34,32.52) ; v1(28.96,6.61) 15.88,6.61 H1.2
  Bottom Layer w0.254: v1(37.34,32.52) 37.21,32.39 37.21,14.86 v1(28.96,6.61)
VOUT+: length 90.7
  Top Layer w0.5: v1(18.16,36.33) 16.38,36.33 D9.2 ; v1(59,35.06) R27.1
  Bottom Layer w0.5: v1(81.41,69.6) 81.41,56.01 60.45,35.06 v1(59,35.06) 57.35,33.41 21.08,33.41 v1(18.16,36.33)
VOUT-: length 60.3
  Top Layer w0.254: R32.1 78.87,35.06 79.5,35.69 79.5,42.93 76.45,45.98 76.45,51.95 77.09,52.58 80.65,52.58 81.03,52.2 R8.1 81.03,49.53 v1(79.38,47.88) ; R28.1 58.55,40.03 58.55,46.11 59.82,47.38 v1(74.93,47.38)
  Bottom Layer w0.254: v1(79.38,47.88) 78.87,47.38 v1(74.93,47.38)
$1N3823: length 9.1
  Top Layer w0.6: D3.1 32.64,58.55 36.96,58.55 ; 36.96,58.55 U1.8 ; 36.96,58.55 36.96,60.13 C9.2
$1N3972: length 13
  Top Layer w0.6: R9.2 34.08,61.15 D5.1 37.08,63.63 38.23,62.49 U1.7
$1N4096: length 7
  Top Layer w0.6: D7.1 42.56,62.68 R11.2 40.77,58.66 U1.5
$1N4511: length 9
  Top Layer w0.6: C10.2 57.15,60.13 U2.8 51.63,57.61 D4.1
$1N4521: length 13
  Top Layer w0.6: U2.7 58.42,62.36 57.15,63.63 D6.1 54.14,61.15 R10.2
$1N4534: length 7.1
  Top Layer w0.6: U2.5 60.96,58.15 R12.2 63.26,62.81 D8.1
$2N358: length 21.3
  Top Layer w0.6: D9.1 9.59,34.34 3.31,34.34 ; C13.2 3.31,31.83 3.31,32.1 ; 3.31,34.34 3.31,32.1 ; 3.31,34.34 D10.1 ; 3.31,32.1 3.58,31.82 6.73,31.82 7.12,32.21 U3.1
$2N478: length 13.5
  Top Layer w0.6: D11.1 8.51,22.87 ; 8.51,22.87 8.25,23.13 8.25,29.98 9.22,30.94 U3.2 ; 8.51,22.87 10.54,22.87 L3.1
$2N910: length 25.3
  Top Layer w0.3: U3.3 v1(9.27,29.67) ; v1(27.81,30.48) 27.85,30.48 27.86,30.47 ; R14.2 R15.1
  Top Layer w0.6: R14.2 C17.1
  Bottom Layer w0.3: v1(9.27,29.67) 27,29.67 v1(27.81,30.48)
$2N1629: length 3.2
  Top Layer w0.6: LED1.2 32.44,3.85 R16.2
$3N444: length 6.4
  Top Layer w0.3: R19.1 R17.2 28.69,44.2 U7.3
$3N584: length 7
  Top Layer w0.3: R20.2 25.54,48.11 R18.2 28.18,45.47 U7.2
$3N593: length 47.1
  Top Layer w0.3: v1(44.32,34.17) 44.32,30.86 49.66,25.53 49.66,22.99 51.69,20.96 54.1,20.96 54.97,20.09 R21.2 ; v1(40.89,41.41) 34.29,41.41 33.02,42.68 33.02,45.85 32.13,46.74 U7.1 29.96,46.74 R20.1
  Bottom Layer w0.3: v1(44.32,34.17) 40.89,37.6 v1(40.89,41.41)
$3N926: length 13.7
  Top Layer w0.3: R22.2 R24.1 44.05,42.93 U7.5
$3N1048: length 7.1
  Top Layer w0.3: U7.6 39.23,44.2 R25.2 R23.2
$3N1128: length 54
  Top Layer w0.254: R26.2 57.28,18.18 57.28,42.04 v1(49.66,49.66) ; v1(40.26,48.26) 40.26,47.23 R25.1
  Top Layer w0.3: R25.1 38.5,45.47 U7.7
  Bottom Layer w0.254: v1(49.66,49.66) 41.66,49.66 v1(40.26,48.26)
$3N1682: length 8
  Top Layer w0.3: U8.3 63.74,36.33 R27.2 60.47,33.06 R29.1
$3N1693: length 7.7
  Top Layer w0.3: U8.2 62.98,37.6 R28.2 62.47,39.15 R30.2
$3N1698: length 50.2
  Top Layer w0.3: R31.2 66.55,11.94 73.41,18.8 73.41,29.85 69.22,34.04 69.22,37.85 68.2,38.87 U8.1 64.75,38.87 R30.1
$3N1715: length 6.8
  Top Layer w0.3: R34.1 R32.2 U8.5
$3N1724: length 8.3
  Top Layer w0.3: R35.2 77.33,40.1 R33.2 73.55,36.33 U8.6
$3N1729: length 30.9
  Top Layer w0.3: v1(69.85,37.6) U8.7 73.15,37.6 74.04,38.48 74.04,39.87 R35.1 ; v1(56.13,23.25) R36.2
  Bottom Layer w0.3: v1(69.85,37.6) 69.85,33.66 62.74,26.55 59.44,26.55 v1(56.13,23.25)
$3N2221: length 11.1
  Top Layer w0.3: 66.06,25.28 63.87,25.28 C29.2 62.55,22.78 R38.2 R37.1
$3N2327: length 52.4
  Top Layer w0.3: v1(76.33,43.69) 75.44,44.58 v1(67.69,44.58) ; v1(56.26,35.44) R39.2 R40.2
  Bottom Layer w0.3: PR1.3 85.64,34.38 v1(76.33,43.69) ; v1(56.26,35.44) 65.41,44.58 v1(67.69,44.58)
$4N871: length 3.5
  Top Layer w0.3: U10.44 36.93,30.75 R41.1
$4N978: length 12.1
  Top Layer w0.3: C35.2 R42.1 44.06,24.15 U10.7
$4N1109: length 2.3
  Top Layer w0.3: R43.2 95.08,15.88 LED2.2
$4N1160: length 2.3
  Top Layer w0.3: R44.2 95.08,12.58 LED3.2
$4N1211: length 2.3
  Top Layer w0.3: R45.2 95.08,9.28 LED4.2

## Copper pours and planes (outline as drawn; the poured copper is in the pictures)
GND on Top Layer: 0.38,37.6 1.27,38.48 27.94,38.48 31.5,34.93 31.8,11.94 27.74,7.88 3.05,7.88 0.38,10.54
GND on Top Layer: 74.8,78.34 74.36,78.79 72.98,78.79 71.75,80.01 71.75,81.67 72.14,82.05 77.34,82.05 79.76,79.63 79.76,66.88 80.21,66.42 86.49,66.42 87.12,65.79 87.12,54.61 86.36,53.85 75.69,53.85 74.8,54.74
GND on Top Layer: 22.86,84.59 20.7,82.43 20.7,67.44 20.07,66.81 14.27,66.81 12.93,65.47 12.93,54.89 13.72,54.11 23.24,54.11 25.27,56.14 25.27,78.49 26.16,79.38 27.31,79.38 27.69,79.76 27.69,84.2 27.31,84.59
GND on Bottom Layer: 2.16,40.14 12.31,40.61 27.08,56.65 65.98,56.65 84.56,37.6 98.04,37.6 99.57,36.07 99.57,1.4 98.55,0.38 1.4,0.38 0.38,1.4 0.38,38.36
GND on Bottom Layer: 0.64,57.66 0.64,92.97 2.03,94.37 98.3,94.37 99.31,93.35 99.31,55.88 97.41,53.98 75.56,53.98 74.68,54.87 74.68,75.19 67.44,82.43 30.35,82.43 27.56,79.63 26.35,79.63 25.3,78.58 25.3,56.29 23.11,54.11 4.19,54.11
VIN+ on Top Layer: 1.91,56.27 10.54,56.27 11.81,57.53 11.81,66.04 12.95,67.19 19.75,67.19 20.32,67.74 20.32,82.55 22.73,84.97 27.94,84.97 28.45,85.47 28.45,94.13 28.06,94.51 1.54,94.51 0.51,93.48 0.51,57.66
VIN- on Top Layer: 6.73,52.58 7.75,53.6 17.14,53.6 18.29,52.45 21.97,52.45 22.48,51.95 22.48,48.77 21.97,48.26 18.42,48.26 17.91,47.76 17.91,41.53 17.02,40.64 7.75,40.64 6.73,41.66
HS-1 on Top Layer: 29.08,94.49 28.83,94.24 28.83,85.35 28.07,84.59 28.07,72.14 28.57,71.63 40.89,71.63 41.4,72.14 41.4,83.82 42.04,84.46 45.34,84.46 45.97,85.09 45.97,93.86 45.34,94.49
HS-2 on Top Layer: 47.62,71.12 50.42,73.92 50.42,77.09 52.58,79.25 64.39,79.25 66.29,81.16 66.29,93.86 66.8,94.37 70.74,94.37 71.25,93.86 71.25,79.92 73.03,78.14 73.03,74.05 67.82,68.84 48.26,68.84 47.62,69.47
VOUT+ on Top Layer: 71.63,93.86 72.14,94.37 98.43,94.37 99.44,93.35 99.44,58.04 97.79,56.39 89.41,56.39 87.88,57.92 87.88,65.96 86.66,67.19 80.52,67.19 80.26,67.44 80.26,79.89 77.72,82.43 72.64,82.43 71.63,83.44
VOUT- on Top Layer: 78.49,51.31 78.99,51.82 82.68,51.82 84.07,53.22 97.92,53.22 99.31,51.82 99.31,41.91 97.92,40.52 89.66,40.52 82.93,47.25 78.99,47.25 78.49,47.76
$1N2170 on Top Layer: 41.78,72.27 41.78,83.57 42.29,84.08 45.59,84.08 46.48,84.97 46.48,93.98 46.99,94.49 65.28,94.49 65.79,93.98 65.79,81.16 64.26,79.63 52.1,79.63 49.85,77.38 49.85,73.99 47.5,71.63 42.42,71.63

Small or netless copper shapes (teardrops, artwork), in the pictures only: 463 on Top Layer, 85 on Bottom Layer

## Text on the board
Top Silkscreen Layer: SWCLK | SWDIO | 5V | TX | RX | GND | + | - | 输出电压调节
